# Altium schematic sheet USB HUB.SchDoc
size 297 x 209 mm; CompanyName: Sainsbury Wellcome Centre; Organization: FabLab; Address1: Sainsbury Wellcome Centre; Address2: 25 Howland Street; Address3: London; Address4: W1T 4JG; DocumentNumber: 6; SheetNumber: 6; SheetTotal: 14; swcgroup: FabLab; Org: Sainsbury Wellcome Centre; Add1: 25 Howland Street; Add2: London; Add3: W1T 4JG; WebAddress: www.sainsburywellcome.org; SheetSize: A4; SheetName: USB HUB
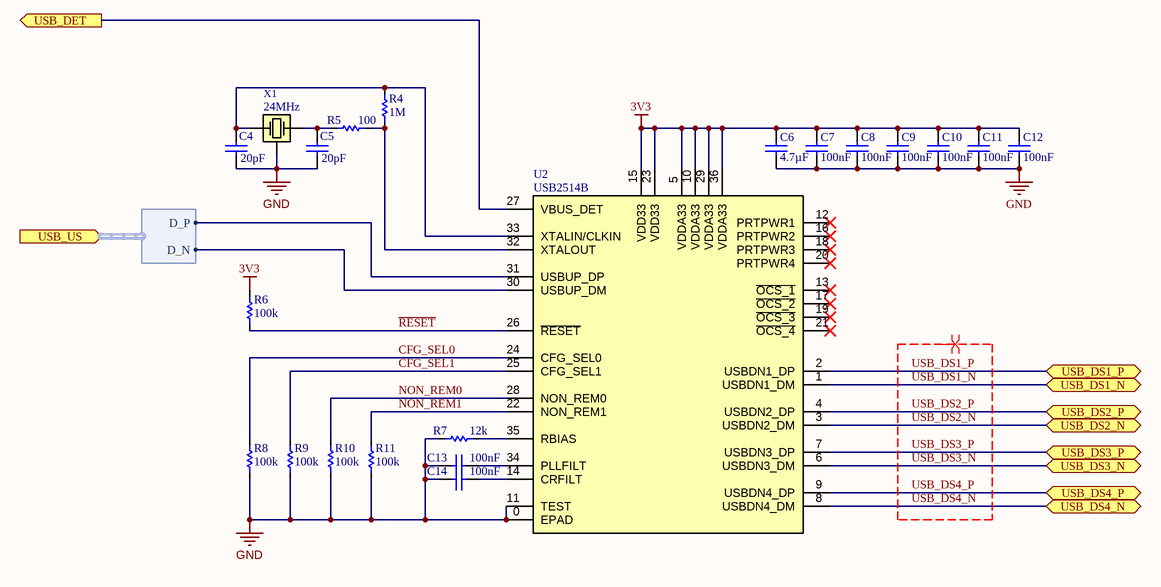
[diagram p0: USB HUB.SchDoc]

## Parts
C4  value 20pF  [CAP_CHIP_0603]  (hidden comment: C0603-20pF-50V)
C5  value 20pF  [CAP_CHIP_0603]  (hidden comment: C0603-20pF-50V)
C6  value 4.7µF  [CAP_CHIP_0603]  (hidden comment: C0603-4.7uF-16V)
C7  value 100nF  [CAP_CHIP_0603]  (hidden comment: C0603-100nF-50V)
C8  value 100nF  [CAP_CHIP_0603]  (hidden comment: C0603-100nF-50V)
C9  value 100nF  [CAP_CHIP_0603]  (hidden comment: C0603-100nF-50V)
C10  value 100nF  [CAP_CHIP_0603]  (hidden comment: C0603-100nF-50V)
C11  value 100nF  [CAP_CHIP_0603]  (hidden comment: C0603-100nF-50V)
C12  value 100nF  [CAP_CHIP_0603]  (hidden comment: C0603-100nF-50V)
C13  value 100nF  [CAP_CHIP_0603]  (hidden comment: C0603-100nF-50V)
C14  value 100nF  [CAP_CHIP_0603]  (hidden comment: C0603-100nF-50V)
R4  value 1M  [RES_CHIP_0603]  (hidden comment: R0603-1M)
R5  value 100  [RES_CHIP_0603]  (hidden comment: R0603-100R)
R6  value 100k  [RES_CHIP_0603]  (hidden comment: R0603-100K)
R7  value 12k  [RES_CHIP_0603]  (hidden comment: R0603-12K)
R8  value 100k  [RES_CHIP_0603]  (hidden comment: R0603-100K)
R9  value 100k  [RES_CHIP_0603]  (hidden comment: R0603-100K)
R10  value 100k  [RES_CHIP_0603]  (hidden comment: R0603-100K)
R11  value 100k  [RES_CHIP_0603]  (hidden comment: R0603-100K)
U2  USB2514B  [QFN36]
X1  Frequency: 24MHz  [OSC_SMD_2520]  (hidden comment: OSC2520-24M)

## Ports
USB_DET (out), USB_DS1_N (bidir), USB_DS1_P (bidir), USB_DS2_N (bidir), USB_DS2_P (bidir), USB_DS3_N (bidir), USB_DS3_P (bidir), USB_DS4_N (bidir), USB_DS4_P (bidir), USB_US (in, harness USB_US)

## Harnesses
USB_US: D_P, D_N

## Nets
3V3: C6.2 C7.2 C8.2 C9.2 C10.2 C11.2 C12.2 R6.1 U2.5(VDDA33) U2.10(VDDA33) U2.15(VDD33) U2.23(VDD33) U2.29(VDDA33) U2.36(VDDA33)
GND: C4.1 C5.1 C6.1 C7.1 C8.1 C9.1 C10.1 C11.1 C12.1 C13.2 C14.2 R7.1 R8.2 R9.2 R10.2 R11.2 U2.0(EPAD) U2.11(TEST) X1.2,4(GND)
CFG_SEL0: R8.1 U2.24(CFG_SEL0)
CFG_SEL1: R9.1 U2.25(CFG_SEL1)
NON_REM0: R10.1 U2.28(NON_REM0)
NON_REM1: R11.1 U2.22(NON_REM1)
~{RESET}: R6.2 U2.26(~{RESET})
USB_DET: U2.27(VBUS_DET) ; port USB_DET
USB_DS1_N: U2.1(USBDN1_DM) ; port USB_DS1_N
USB_DS1_P: U2.2(USBDN1_DP) ; port USB_DS1_P
USB_DS2_N: U2.3(USBDN2_DM) ; port USB_DS2_N
USB_DS2_P: U2.4(USBDN2_DP) ; port USB_DS2_P
USB_DS3_N: U2.6(USBDN3_DM) ; port USB_DS3_N
USB_DS3_P: U2.7(USBDN3_DP) ; port USB_DS3_P
USB_DS4_N: U2.8(USBDN4_DM) ; port USB_DS4_N
USB_DS4_P: U2.9(USBDN4_DP) ; port USB_DS4_P
NetC4_2: C4.2 R4.1 U2.33(XTALIN/CLKIN) X1.1
NetC5_2: C5.2 R5.1 X1.3
NetC13_1: C13.1 U2.34(PLLFILT)
NetC14_1: C14.1 U2.14(CRFILT)
NetR4_2: R4.2 R5.2 U2.32(XTALOUT)
NetR7_2: R7.2 U2.35(RBIAS)
NetU2_30: U2.30(USBUP_DM) ; port USB_US.D_N
NetU2_31: U2.31(USBUP_DP) ; port USB_US.D_P

Not connected (* = marked no-connect by the designer): U2 12(PRTPWR1)* 13(~{OCS_1})* 16(PRTPWR2)* 17(~{OCS_2})* 18(PRTPWR3)* 19(~{OCS_3})* 20(PRTPWR4)* 21(~{OCS_4})*

## Layout directives
differential pair; differential pair class USB: USB_DS1_N, USB_DS1_P, USB_DS2_N, USB_DS2_P, USB_DS3_N, USB_DS3_P, USB_DS4_N, USB_DS4_P

## Notes on the sheet
- FILE
- VARIANT
- DATE
- REVISION
- SHEET
- /
- PROJECT
- SIZE

## Library data of the parts
C4 C5 = CMP-611-0064-3: 0603 Multilayer Ceramic Capacitors MLCC; PartNumber: CL10C200JB8NNNC; Dielectric: C0G; Tolerance: 5%; Voltage Rating: 50V; Pick&PlaceFootprint: C0603; Capacitor Type: Ceramic; RoHS: Yes; LCSC Part N.: C1648; Case/Package: 0603; Mount: SMD
C6 = CMP-611-0056-4: 0603 Multilayer Ceramic Capacitors MLCC; PartNumber: CL10A475KO8NNNC; Tolerance: 10%; Voltage Rating: 16V; Dielectric: X5R; Pick&PlaceFootprint: C0603; LCSC Part N.: C19666; RoHS: Yes; Mount: SMD; Case/Package: 0603; Capacitor Type: Ceramic
C7-C14 = CMP-611-0027-24: 0603 Multilayer Ceramic Capacitors MLCC; PartNumber: CC0603KRX7R9BB104; Voltage Rating: 50V; Pick&PlaceFootprint: C0603; Dielectric: X7R; Tolerance: 10%; LCSC Part N.: C14663; Capacitor Type: Ceramic; Case/Package: 0603; RoHS: Yes; Mount: SMD
R4 = CMP-633-0066-20: 100mW Thick Film Resistors 75V ±100ppm/℃ ±1% 0603 Chip Resistor; PartNumber: 0603WAF1004T5E; Number of Resistors: 1; Pick&PlaceFootprint: R0603; Voltage Rating: 75V; Mount: Surface Mount; LCSC Part N.: C22935; Power Rating: 100mW; Tolerance: 1%; Case/Package: 0603
R5 = CMP-633-0094-12: 100mW Thick Film Resistors 75V ±100ppm/℃ ±1% 0603 Chip Resistor; PartNumber: 0603WAF1000T5E; Number of Resistors: 1; Pick&PlaceFootprint: R0603; Case/Package: 0603; Voltage Rating: 75V; Mount: Surface Mount; Tolerance: 1%; LCSC Part N.: C22775; Power Rating: 100mW
R6 R8-R11 = CMP-633-0000-28: 100mW Thick Film Resistors 75V ±100ppm/℃ ±1% 0603 Chip Resistor; PartNumber: 0603WAF1003T5E; Number of Resistors: 1; Pick&PlaceFootprint: R0603; Case/Package: 0603; Tolerance: 1%; Voltage Rating: 75V; LCSC Part N.: C25803; Power Rating: 100mW; Mount: Surface Mount
R7 = CMP-633-0106-3: 100mW Thick Film Resistors 75V ±100ppm/℃ ±1% 0603 Chip Resistor; PartNumber: 0603WAF1202T5E; Pick&PlaceFootprint: R0603; Number of Resistors: 1; Voltage Rating: 75V; Power Rating: 100mW; Tolerance: 1%; Mount: Surface Mount; Case/Package: 0603; LCSC Part N.: C22790
U2 = CMP-930-0006-5: USB251xB Series 3.6 V Surface Mount USB 2.0 Hi-Speed Hub Controller - QFN-36; PartNumber: USB2514B-AEZC-TR; Number of Ports: 4; Operating Supply Voltage: 3.3V; Data Rate: 480Mbps; LCSC Part N.: C16251; Pick&PlaceFootprint: QFN36
X1 = CMP-400-0005-2: SMD XTL MHZ +/-10PPM, +/-15PPM-30-85C 12.0PF 250T/R; pin to pad: 2>2+4; PartNumber: Q24FA20H00153; Load Capatitance: 12pF; Type: Passive; Mount: SMD; LCSC Part N.: C255951